# EAGLE design BLE_Emergency_lights_v1.0 (EAGLE 9.6.2)
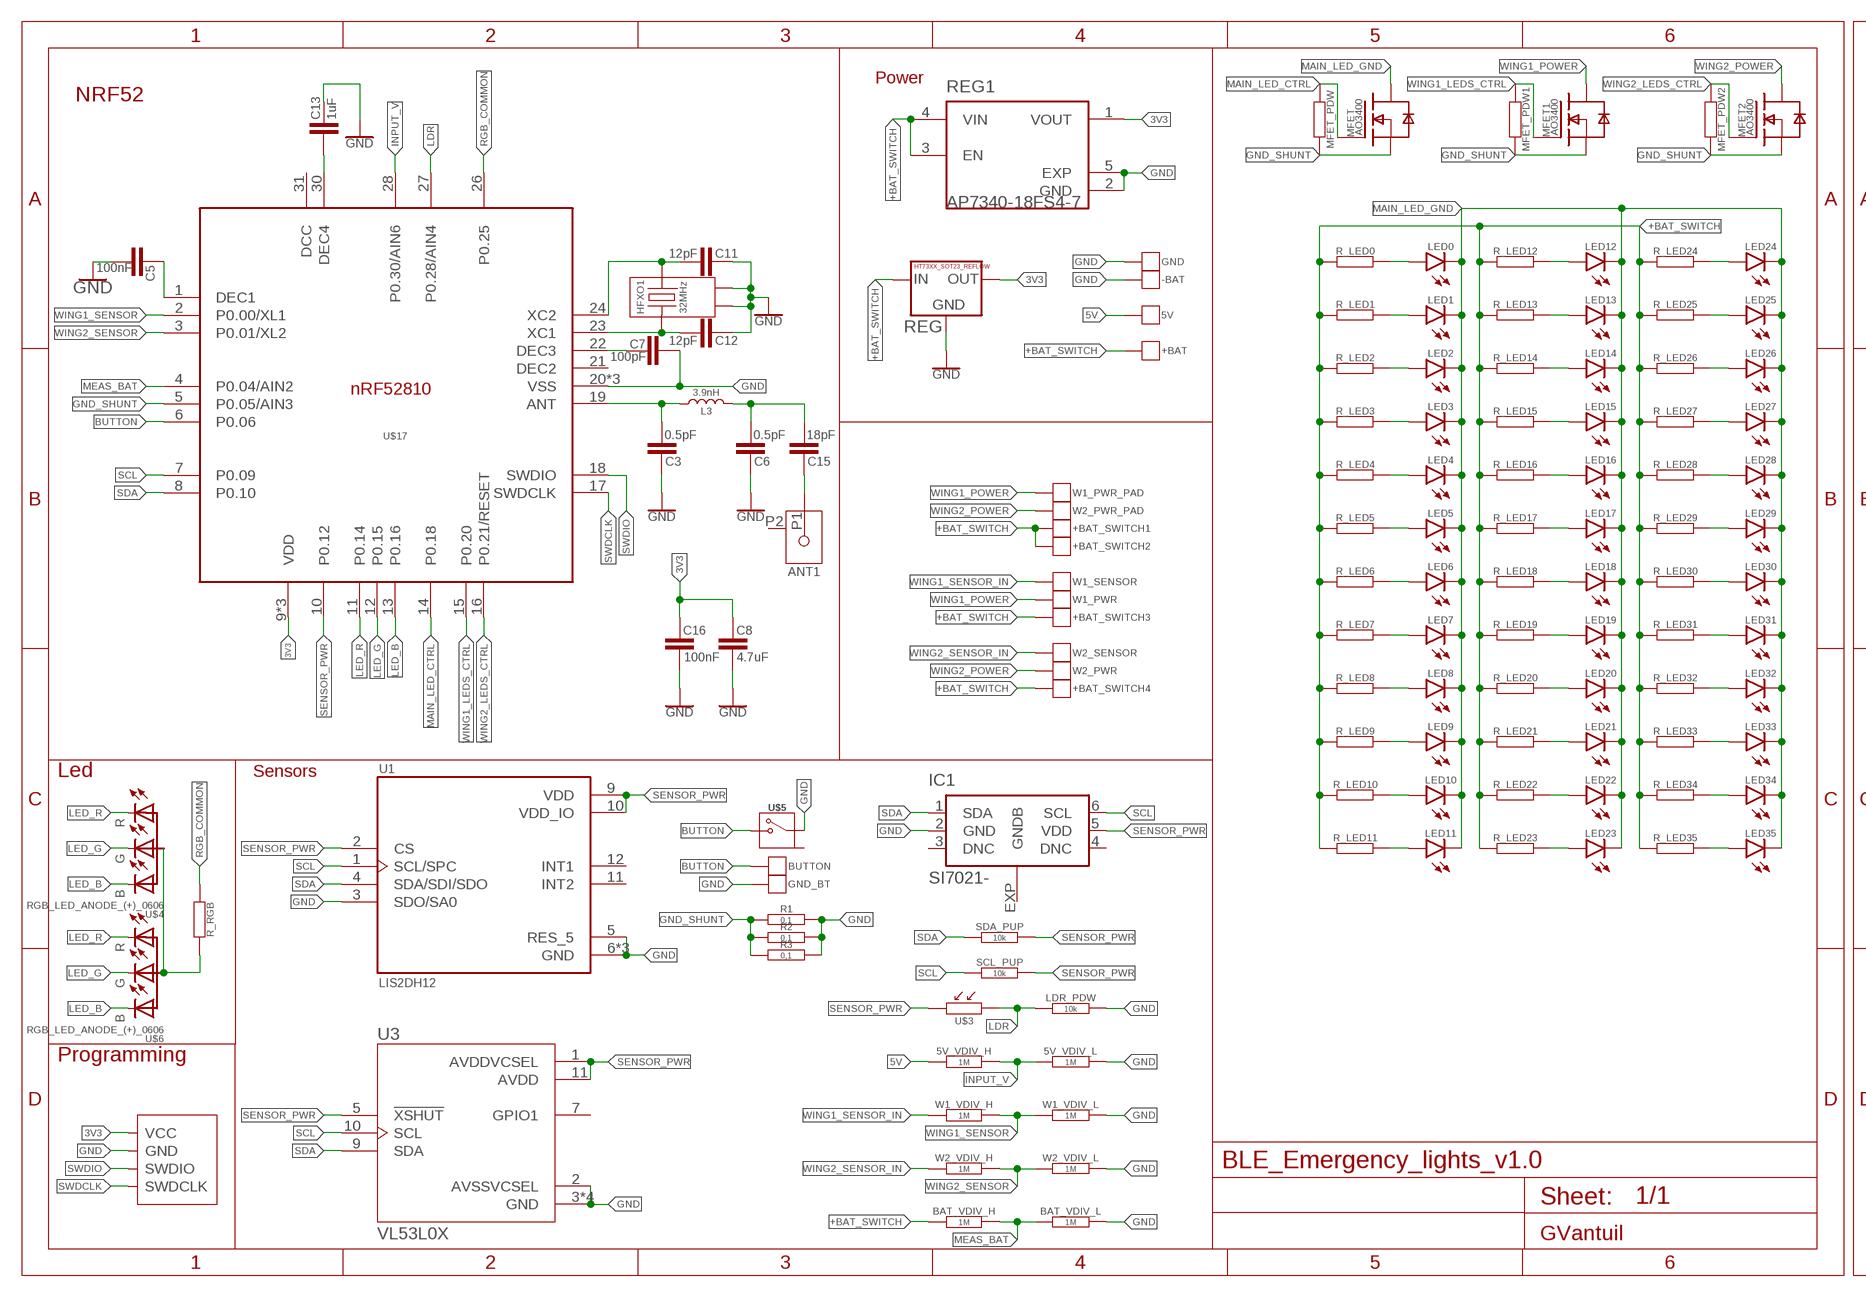
[diagram p0: schematic, sheet 1, part 1 of 2]
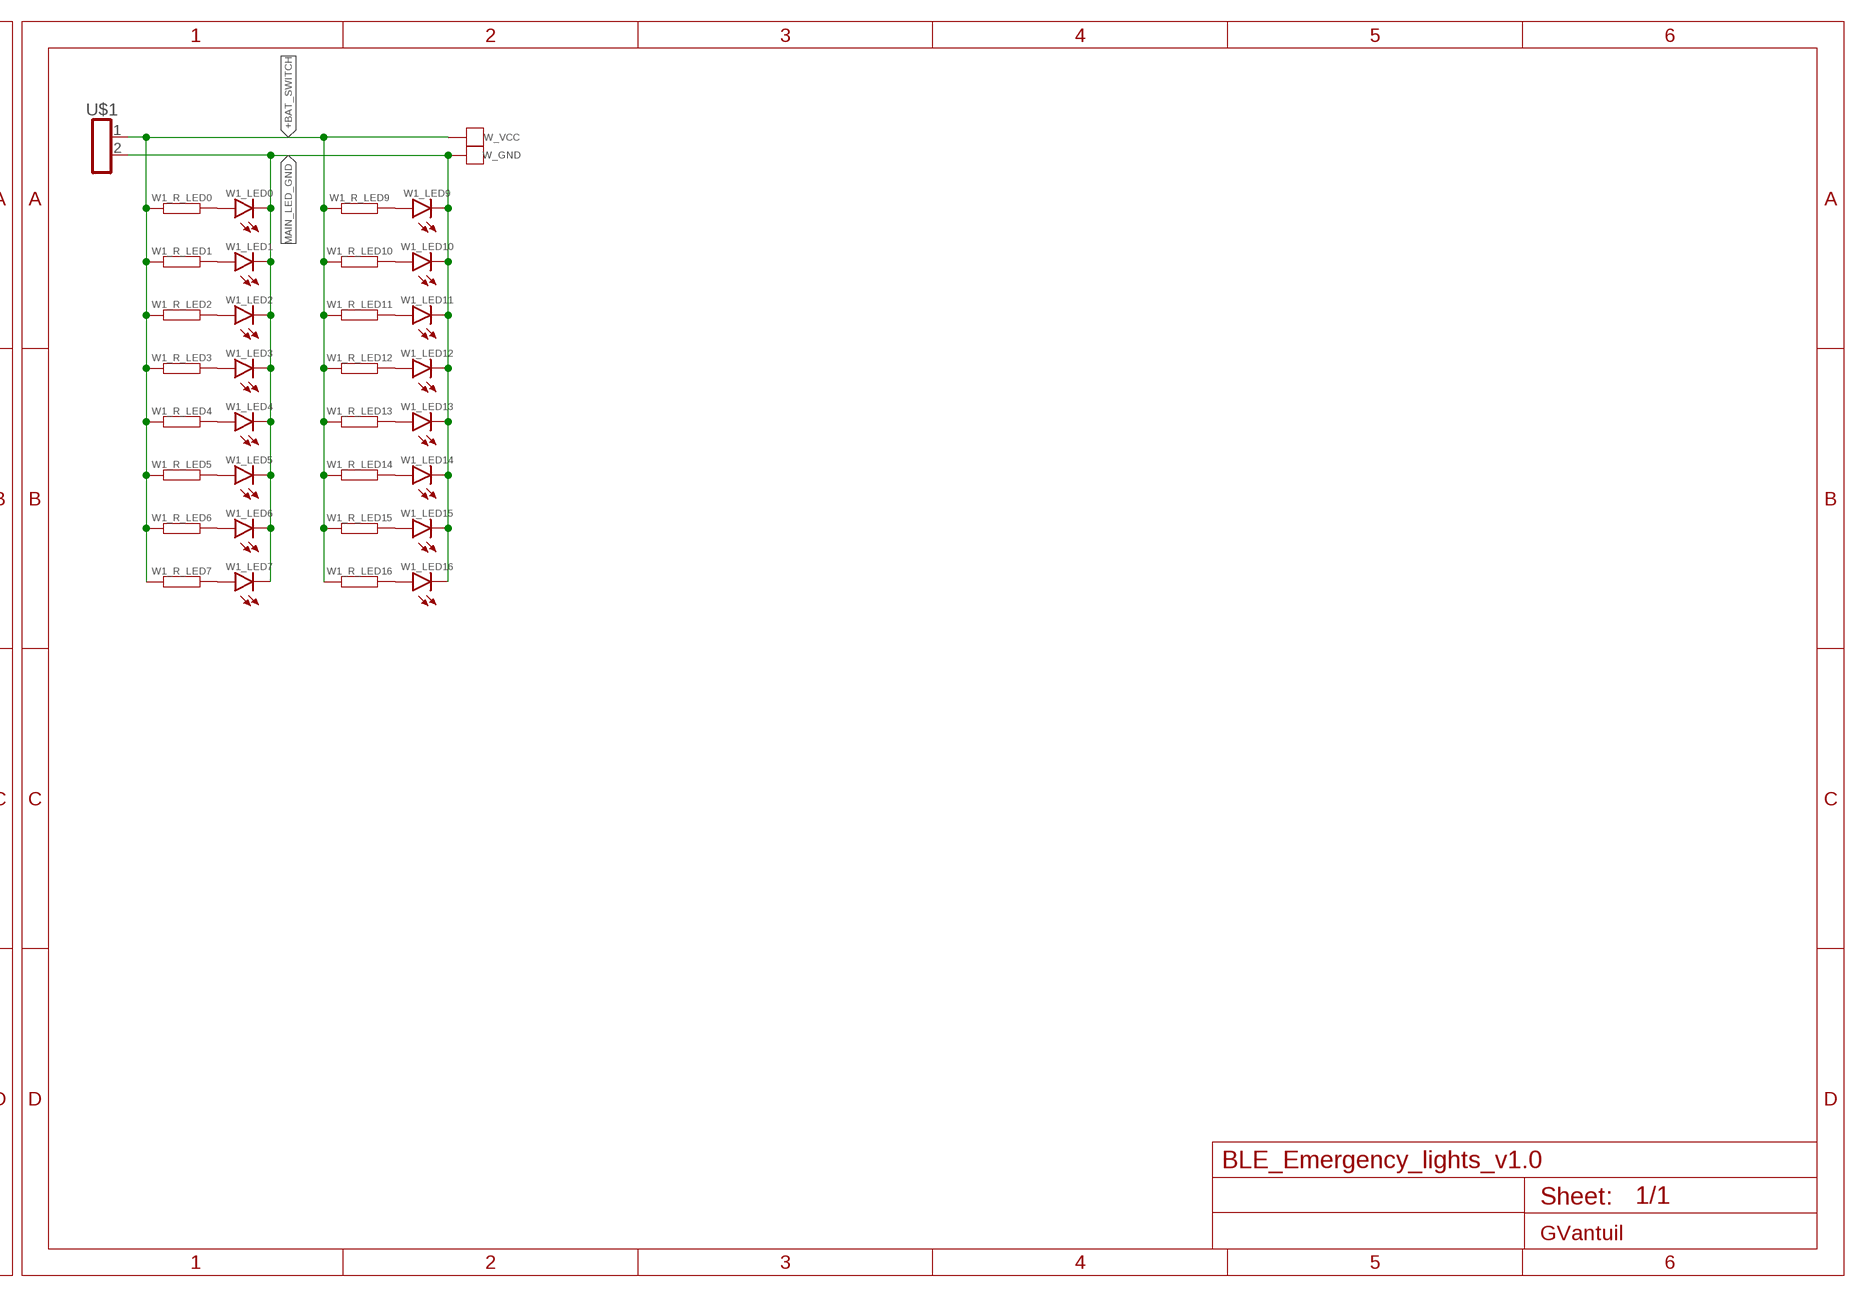
[diagram p1: schematic, sheet 1, part 2 of 2]

## Parts
5V  PAD_50X100MIL  [PAD_50X100MIL]
5V_VDIV_H  1M  RESISTOR0402-RES  [0402-RES]
5V_VDIV_L  1M  RESISTOR0402-RES  [0402-RES]
+BAT  PAD_50X100MIL  [PAD_50X100MIL]
+BAT_SWITCH1  PAD_50X100MIL  [PAD_50X100MIL]
+BAT_SWITCH2  PAD_50X100MIL  [PAD_50X100MIL]
+BAT_SWITCH3  SMD_VERTICAL_POGOPIN_0.8MM  [POGOPIN_0.8T]
+BAT_SWITCH4  SMD_VERTICAL_POGOPIN_0.8MM  [POGOPIN_0.8T]
-BAT  PAD_50X100MIL  [PAD_50X100MIL]
ANT1  ANT3216LL00R2400A  [ANT3216LL00R2400A]
BAT_VDIV_H  1M  RESISTOR0402-RES  [0402-RES]
BAT_VDIV_L  1M  RESISTOR0402-RES  [0402-RES]
BUTTON  PAD_50X100MIL  [PAD_50X100MIL]
C3  0.5pF  CAP_0201_LARGE_FP-CAP  [0201_LARGE_FP-CAP]
C5  100nF  CAP_0201_LARGE_FP-CAP  [0201_LARGE_FP-CAP]
C6  0.5pF  CAP_0201_LARGE_FP-CAP  [0201_LARGE_FP-CAP]
C7  100pF  CAP_0201_LARGE_FP-CAP  [0201_LARGE_FP-CAP]
C8  4.7uF  CAP_0402-CAP  [0402-CAP]
C11  12pF  CAP_0201_LARGE_FP-CAP  [0201_LARGE_FP-CAP]
C12  12pF  CAP_0201_LARGE_FP-CAP  [0201_LARGE_FP-CAP]
C13  1uF  CAP_0201_LARGE_FP-CAP  [0201_LARGE_FP-CAP]
C15  18pF  CAP_0201_LARGE_FP-CAP  [0201_LARGE_FP-CAP]
C16  100nF  CAP_0201_LARGE_FP-CAP  [0201_LARGE_FP-CAP]
GND  PAD_50X100MIL  [PAD_50X100MIL]
GND_BT  PAD_50X100MIL  [PAD_50X100MIL]
HFXO1  32MHz  XTAL_CX2016DB16000D0WZRC1  [XTAL_CX2016DB16000D0WZRC1]
IC1  SI7021-  [DFN6-3X3]
L3  3.9nH  IND_0201_LARGE_FP  [0201_LARGE_FP-CAP]
LDR_PDW  10k  RESISTOR0402-RES  [0402-RES]
LED0  LED_1210  [1210]
LED1  LED_1210  [1210]
LED2  LED_1210  [1210]
LED3  LED_1210  [1210]
LED4  LED_1210  [1210]
LED5  LED_1210  [1210]
LED6  LED_1210  [1210]
LED7  LED_1210  [1210]
LED8  LED_1210  [1210]
LED9  LED_1210  [1210]
LED10  LED_1210  [1210]
LED11  LED_1210  [1210]
LED12  LED_1210  [1210]
LED13  LED_1210  [1210]
LED14  LED_1210  [1210]
LED15  LED_1210  [1210]
LED16  LED_1210  [1210]
LED17  LED_1210  [1210]
LED18  LED_1210  [1210]
LED19  LED_1210  [1210]
LED20  LED_1210  [1210]
LED21  LED_1210  [1210]
LED22  LED_1210  [1210]
LED23  LED_1210  [1210]
LED24  LED_1210  [1210]
LED25  LED_1210  [1210]
LED26  LED_1210  [1210]
LED27  LED_1210  [1210]
LED28  LED_1210  [1210]
LED29  LED_1210  [1210]
LED30  LED_1210  [1210]
LED31  LED_1210  [1210]
LED32  LED_1210  [1210]
LED33  LED_1210  [1210]
LED34  LED_1210  [1210]
LED35  LED_1210  [1210]
MFET  AO3400  [SOT23-3]
MFET1  AO3400  [SOT23-3]
MFET2  AO3400  [SOT23-3]
MFET_PDW  RESISTOR0402-RES  [0402-RES]
MFET_PDW1  RESISTOR0402-RES  [0402-RES]
MFET_PDW2  RESISTOR0402-RES  [0402-RES]
R1  0,1  RESISTOR1206  [1206]
R2  0,1  RESISTOR1206  [1206]
R3  0,1  RESISTOR1206  [1206]
R_LED0  RESISTOR0603-RES  [0603-RES]
R_LED1  RESISTOR0603-RES  [0603-RES]
R_LED2  RESISTOR0603-RES  [0603-RES]
R_LED3  RESISTOR0603-RES  [0603-RES]
R_LED4  RESISTOR0603-RES  [0603-RES]
R_LED5  RESISTOR0603-RES  [0603-RES]
R_LED6  RESISTOR0603-RES  [0603-RES]
R_LED7  RESISTOR0603-RES  [0603-RES]
R_LED8  RESISTOR0603-RES  [0603-RES]
R_LED9  RESISTOR0603-RES  [0603-RES]
R_LED10  RESISTOR0603-RES  [0603-RES]
R_LED11  RESISTOR0603-RES  [0603-RES]
R_LED12  RESISTOR0603-RES  [0603-RES]
R_LED13  RESISTOR0603-RES  [0603-RES]
R_LED14  RESISTOR0603-RES  [0603-RES]
R_LED15  RESISTOR0603-RES  [0603-RES]
R_LED16  RESISTOR0603-RES  [0603-RES]
R_LED17  RESISTOR0603-RES  [0603-RES]
R_LED18  RESISTOR0603-RES  [0603-RES]
R_LED19  RESISTOR0603-RES  [0603-RES]
R_LED20  RESISTOR0603-RES  [0603-RES]
R_LED21  RESISTOR0603-RES  [0603-RES]
R_LED22  RESISTOR0603-RES  [0603-RES]
R_LED23  RESISTOR0603-RES  [0603-RES]
R_LED24  RESISTOR0603-RES  [0603-RES]
R_LED25  RESISTOR0603-RES  [0603-RES]
R_LED26  RESISTOR0603-RES  [0603-RES]
R_LED27  RESISTOR0603-RES  [0603-RES]
R_LED28  RESISTOR0603-RES  [0603-RES]
R_LED29  RESISTOR0603-RES  [0603-RES]
R_LED30  RESISTOR0603-RES  [0603-RES]
R_LED31  RESISTOR0603-RES  [0603-RES]
R_LED32  RESISTOR0603-RES  [0603-RES]
R_LED33  RESISTOR0603-RES  [0603-RES]
R_LED34  RESISTOR0603-RES  [0603-RES]
R_LED35  RESISTOR0603-RES  [0603-RES]
R_RGB  RESISTOR_0201_LARGE_FP  [0201_LARGE_FT-RES]
REG  HT73XX_SOT23_REFLOW  [SOT23-R]
REG1  AP7340-18FS4-7  [VREG_AP7340-18FS4-7]
SCL_PUP  10k  RESISTOR0402-RES  [0402-RES]
SDA_PUP  10k  RESISTOR0402-RES  [0402-RES]
U1  LIS2DH12  [SENSOR_LIS2DH12]
U3  VL53L0X  [SENSOR_VL53L0X]
U$1  RING_PAD_02_4X6  [2X_RING_PAD_4X6]
U$3  LDR_5MM  [LDR_5MM]
U$4  RGB_LED_ANODE_(+)_0606  [LED_RGB_0606]
U$5  PUSHBUTTON_2X4X3.5  [2X4X3.5MM]
U$6  RGB_LED_ANODE_(+)_0606  [LED_RGB_0606]
U$9  GV_SWD_4P  [GV_SWD_1.27MM_4P_SEMI_SMD]
U$17  NRF52810-QFN32  [QFN32-SMALL_PADS2]
W1_LED0  LED_1210  [1210]
W1_LED1  LED_1210  [1210]
W1_LED2  LED_1210  [1210]
W1_LED3  LED_1210  [1210]
W1_LED4  LED_1210  [1210]
W1_LED5  LED_1210  [1210]
W1_LED6  LED_1210  [1210]
W1_LED7  LED_1210  [1210]
W1_LED9  LED_1210  [1210]
W1_LED10  LED_1210  [1210]
W1_LED11  LED_1210  [1210]
W1_LED12  LED_1210  [1210]
W1_LED13  LED_1210  [1210]
W1_LED14  LED_1210  [1210]
W1_LED15  LED_1210  [1210]
W1_LED16  LED_1210  [1210]
W1_PWR  SMD_VERTICAL_POGOPIN_0.8MM  [POGOPIN_0.8T]
W1_PWR_PAD  PAD_50X100MIL  [PAD_50X100MIL]
W1_R_LED0  RESISTOR0603-RES  [0603-RES]
W1_R_LED1  RESISTOR0603-RES  [0603-RES]
W1_R_LED2  RESISTOR0603-RES  [0603-RES]
W1_R_LED3  RESISTOR0603-RES  [0603-RES]
W1_R_LED4  RESISTOR0603-RES  [0603-RES]
W1_R_LED5  RESISTOR0603-RES  [0603-RES]
W1_R_LED6  RESISTOR0603-RES  [0603-RES]
W1_R_LED7  RESISTOR0603-RES  [0603-RES]
W1_R_LED9  RESISTOR0603-RES  [0603-RES]
W1_R_LED10  RESISTOR0603-RES  [0603-RES]
W1_R_LED11  RESISTOR0603-RES  [0603-RES]
W1_R_LED12  RESISTOR0603-RES  [0603-RES]
W1_R_LED13  RESISTOR0603-RES  [0603-RES]
W1_R_LED14  RESISTOR0603-RES  [0603-RES]
W1_R_LED15  RESISTOR0603-RES  [0603-RES]
W1_R_LED16  RESISTOR0603-RES  [0603-RES]
W1_SENSOR  SMD_VERTICAL_POGOPIN_0.8MM  [POGOPIN_0.8T]
W1_VDIV_H  1M  RESISTOR0402-RES  [0402-RES]
W1_VDIV_L  1M  RESISTOR0402-RES  [0402-RES]
W2_PWR  SMD_VERTICAL_POGOPIN_0.8MM  [POGOPIN_0.8T]
W2_PWR_PAD  PAD_50X100MIL  [PAD_50X100MIL]
W2_SENSOR  SMD_VERTICAL_POGOPIN_0.8MM  [POGOPIN_0.8T]
W2_VDIV_H  1M  RESISTOR0402-RES  [0402-RES]
W2_VDIV_L  1M  RESISTOR0402-RES  [0402-RES]
W_GND  PINH1X01_0.8MM  [0.8MM]
W_VCC  PINH1X01_0.8MM  [0.8MM]

## Nets
3V3: C8.1 C16.1 REG1.1(VOUT) REG.2(3.OUT) U$9.VCC U$17.9(VDD) U$17.25(VDD) U$17.32(VDD)
5V: 5V.P$1 5V_VDIV_H.2
+BAT_SWITCH: +BAT.P$1 +BAT_SWITCH1.P$1 +BAT_SWITCH2.P$1 +BAT_SWITCH3.P$1 +BAT_SWITCH4.P$1 BAT_VDIV_H.2 R_LED0.1 R_LED1.1 R_LED2.1 R_LED3.1 R_LED4.1 R_LED5.1 R_LED6.1 R_LED7.1 R_LED8.1 R_LED9.1 R_LED10.1 R_LED11.1 R_LED12.1 R_LED13.1 R_LED14.1 R_LED15.1 R_LED16.1 R_LED17.1 R_LED18.1 R_LED19.1 R_LED20.1 R_LED21.1 R_LED22.1 R_LED23.1 R_LED24.1 R_LED25.1 R_LED26.1 R_LED27.1 R_LED28.1 R_LED29.1 R_LED30.1 R_LED31.1 R_LED32.1 R_LED33.1 R_LED34.1 R_LED35.1 REG1.3(EN) REG1.4(VIN) REG.3(1.IN) U$1.1 W1_R_LED0.1 W1_R_LED1.1 W1_R_LED2.1 W1_R_LED3.1 W1_R_LED4.1 W1_R_LED5.1 W1_R_LED6.1 W1_R_LED7.1 W1_R_LED9.1 W1_R_LED10.1 W1_R_LED11.1 W1_R_LED12.1 W1_R_LED13.1 W1_R_LED14.1 W1_R_LED15.1 W1_R_LED16.1 W_VCC.P$1
ANT1: C3.1 L3.1 U$17.19(ANT)
ANT2: C6.1 C15.1 L3.2
BUTTON: BUTTON.P$1 U$5.1 U$17.6(P0.06)
GND: 5V_VDIV_L.2 -BAT.P$1 BAT_VDIV_L.2 C3.2 C5.2 C6.2 C7.1 C8.2 C11.1 C12.1 C13.1 C16.2 GND.P$1 GND_BT.P$1 HFXO1.2 HFXO1.4 IC1.2(GND) LDR_PDW.2 R1.2 R2.2 R3.2 REG1.2(GND) REG1.5(EXP) REG.1(2.GND) U1.3(SDO/SA0) U1.5(RES_5) U1.6(GND) U1.7(GND) U1.8(GND) U3.2(AVSSVCSEL) U3.3(GND) U3.4(GND) U3.6(GND) U3.12(GND) U$5.2 U$9.GND U$17.20(VSS) U$17.29(VSS) U$17.EXP(VSS) W1_VDIV_L.2 W2_VDIV_L.2
GND_SHUNT: MFET1.2(S) MFET2.2(S) MFET.2(S) MFET_PDW1.2 MFET_PDW2.2 MFET_PDW.2 R1.1 R2.1 R3.1 U$17.5(P0.05/AIN3)
INPUT_V: 5V_VDIV_H.1 5V_VDIV_L.1 U$17.28(P0.30/AIN6)
LDR: LDR_PDW.1 U$3.P$2 U$17.27(P0.28/AIN4)
LED_B: U$4.B(LED_BLUE) U$6.B(LED_BLUE) U$17.13(P0.16)
LED_G: U$4.G(LED_GREEN) U$6.G(LED_GREEN) U$17.12(P0.15)
LED_R: U$4.R(LED_RED) U$6.R(LED_RED) U$17.11(P0.14)
MAIN_LED_CTRL: MFET.1(G) MFET_PDW.1 U$17.14(P0.18)
MAIN_LED_GND [pwr]: LED0.C LED1.C LED2.C LED3.C LED4.C LED5.C LED6.C LED7.C LED8.C LED9.C LED10.C LED11.C LED12.C LED13.C LED14.C LED15.C LED16.C LED17.C LED18.C LED19.C LED20.C LED21.C LED22.C LED23.C LED24.C LED25.C LED26.C LED27.C LED28.C LED29.C LED30.C LED31.C LED32.C LED33.C LED34.C LED35.C MFET.3(D) U$1.2 W1_LED0.C W1_LED1.C W1_LED2.C W1_LED3.C W1_LED4.C W1_LED5.C W1_LED6.C W1_LED7.C W1_LED9.C W1_LED10.C W1_LED11.C W1_LED12.C W1_LED13.C W1_LED14.C W1_LED15.C W1_LED16.C W_GND.P$1
MEAS_BAT: BAT_VDIV_H.1 BAT_VDIV_L.1 U$17.4(P0.04/AIN2)
N$3: ANT1.P1 C15.2
N$4: C7.2 U$17.22(DEC3)
N$5 [pwr]: LED0.A R_LED0.2
N$6: C13.2 U$17.30(DEC4)
N$8 [pwr]: LED1.A R_LED1.2
N$9: R_RGB.2 U$4.COM(COMMON_ANODE) U$6.COM(COMMON_ANODE)
N$10 [pwr]: LED2.A R_LED2.2
N$11: C12.2 HFXO1.3 U$17.23(XC1)
N$12: C11.2 HFXO1.1 U$17.24(XC2)
N$13 [pwr]: LED3.A R_LED3.2
N$14: C5.1 U$17.1(DEC1)
N$15 [pwr]: LED4.A R_LED4.2
N$17 [pwr]: LED5.A R_LED5.2
N$18 [pwr]: LED6.A R_LED6.2
N$19 [pwr]: LED7.A R_LED7.2
N$20 [pwr]: LED8.A R_LED8.2
N$21 [pwr]: LED9.A R_LED9.2
N$22 [pwr]: LED10.A R_LED10.2
N$23 [pwr]: LED11.A R_LED11.2
N$24 [pwr]: LED12.A R_LED12.2
N$25 [pwr]: LED13.A R_LED13.2
N$26 [pwr]: LED14.A R_LED14.2
N$27 [pwr]: LED15.A R_LED15.2
N$28 [pwr]: LED16.A R_LED16.2
N$29 [pwr]: LED17.A R_LED17.2
N$30 [pwr]: LED18.A R_LED18.2
N$31 [pwr]: LED19.A R_LED19.2
N$32 [pwr]: LED20.A R_LED20.2
N$33 [pwr]: LED21.A R_LED21.2
N$34 [pwr]: LED22.A R_LED22.2
N$35 [pwr]: LED23.A R_LED23.2
N$36 [pwr]: LED24.A R_LED24.2
N$37 [pwr]: LED25.A R_LED25.2
N$38 [pwr]: LED26.A R_LED26.2
N$39 [pwr]: LED27.A R_LED27.2
N$40 [pwr]: LED28.A R_LED28.2
N$41 [pwr]: LED29.A R_LED29.2
N$42 [pwr]: LED30.A R_LED30.2
N$43 [pwr]: LED31.A R_LED31.2
N$44 [pwr]: LED32.A R_LED32.2
N$45 [pwr]: LED33.A R_LED33.2
N$46 [pwr]: LED34.A R_LED34.2
N$47 [pwr]: LED35.A R_LED35.2
N$48: W1_LED0.A W1_R_LED0.2
N$49: W1_LED1.A W1_R_LED1.2
N$50: W1_LED2.A W1_R_LED2.2
N$51: W1_LED3.A W1_R_LED3.2
N$52: W1_LED4.A W1_R_LED4.2
N$53: W1_LED5.A W1_R_LED5.2
N$54: W1_LED6.A W1_R_LED6.2
N$55: W1_LED7.A W1_R_LED7.2
N$59: W1_LED9.A W1_R_LED9.2
N$60: W1_LED10.A W1_R_LED10.2
N$61: W1_LED11.A W1_R_LED11.2
N$62: W1_LED12.A W1_R_LED12.2
N$63: W1_LED13.A W1_R_LED13.2
N$64: W1_LED14.A W1_R_LED14.2
N$65: W1_LED15.A W1_R_LED15.2
N$66: W1_LED16.A W1_R_LED16.2
RGB_COMMON: R_RGB.1 U$17.26(P0.25)
SCL: IC1.6(SCL) SCL_PUP.1 U1.1(SCL/SPC) U3.10(SCL) U$17.7(P0.09)
SDA: IC1.1(SDA) SDA_PUP.1 U1.4(SDA/SDI/SDO) U3.9(SDA) U$17.8(P0.10)
SENSOR_PWR: IC1.5(VDD) SCL_PUP.2 SDA_PUP.2 U1.2(CS) U1.9(VDD) U1.10(VDD_IO) U3.1(AVDDVCSEL) U3.5(!XSHUT) U3.11(AVDD) U$3.P$1 U$17.10(P0.12)
SWDCLK: U$9.SWDCLK U$17.17(SWDCLK)
SWDIO: U$9.SWDIO U$17.18(SWDIO)
WING1_LEDS_CTRL: MFET1.1(G) MFET_PDW1.1 U$17.15(P0.20)
WING1_POWER [pwr]: MFET1.3(D) W1_PWR.P$1 W1_PWR_PAD.P$1
WING1_SENSOR: U$17.2(P0.00/XL1) W1_VDIV_H.1 W1_VDIV_L.1
WING1_SENSOR_IN: W1_SENSOR.P$1 W1_VDIV_H.2
WING2_LEDS_CTRL: MFET2.1(G) MFET_PDW2.1 U$17.16(P0.21/RESET)
WING2_POWER [pwr]: MFET2.3(D) W2_PWR.P$1 W2_PWR_PAD.P$1
WING2_SENSOR: U$17.3(P0.01/XL2) W2_VDIV_H.1 W2_VDIV_L.1
WING2_SENSOR_IN: W2_SENSOR.P$1 W2_VDIV_H.2
Unconnected: ANT1.P2 IC1.3(DNC) IC1.4(DNC) IC1.EXP(GNDB) U1.11(INT2) U1.12(INT1) U3.7(GPIO1) U$5.SHIELD2(GND) U$5.SHIELD(GND) U$17.21(DEC2) U$17.31(DCC)

## Notes on the sheet
- Power
- NRF52
- Led | Sensors
- Programming

## Library data of the parts
5V +BAT +BAT_SWITCH1 +BAT_SWITCH2 -BAT BUTTON GND GND_BT W1_PWR_PAD W2_PWR_PAD = 0000_GV_connectors:PAD
5V_VDIV_H 5V_VDIV_L BAT_VDIV_H BAT_VDIV_L LDR_PDW MFET_PDW MFET_PDW1 MFET_PDW2 R1-R3 R_LED0 R_LED1-R_LED35 R_RGB SCL_PUP SDA_PUP W1_R_LED0 W1_R_LED1-W1_R_LED7 W1_R_LED9-W1_R_LED16 W1_VDIV_H W1_VDIV_L W2_VDIV_H W2_VDIV_L = 0000_GV_resistors:RESISTOR: Resistor Basic schematic elements and footprints for 0603, 1206, and PTH 1/10th watt (small) resistors.
+BAT_SWITCH3 +BAT_SWITCH4 W1_PWR W1_SENSOR W2_PWR W2_SENSOR = 0000_GV_connectors:SMD_VERTICAL_POGOPIN
ANT1 = 0000_GV_antennas:ANT3216LL00R2400A
C3 C5-C8 C11-C13 C15 C16 = 0000_GV_capacitors:CAP_: Capacitor Standard 0603 ceramic capacitor, and 0.1" leaded capacitor.
HFXO1 = 0000_GV_cristal_and _timers:XTAL: Crystal 16MHz 8pF 4-Pin SMD Check availability <https://pricing.snapeda.com/parts/CX2016DB16000D0WZRC1/Kyocera%20AVX/view-part?ref=eda>; AVAILABILITY: In Stock; MF: Kyocera AVX; MP: CX2016DB16000D0WZRC1; PACKAGE: None; PRICE: None; PURCHASE-URL: https://pricing.snapeda.com/search/part/CX2016DB16000D0WZRC1/?ref=eda
IC1 = 0000_GV_sensors:SI7021-*: I2C Humidity and Temperature Sensor Source: http://www.silabs.com/Support%20Documents/TechnicalDocs/Si7021.pdf
L3 = 0000_GV_inductors:IND
LED0 LED1-LED35 W1_LED0 W1_LED1-W1_LED7 W1_LED9-W1_LED16 = 0000_GV_Leds:LED
MFET MFET1 MFET2 = 0000_GV_transistors:AO3400: Check prices <https://pricing.snapeda.com/parts/AO3400/Alpha%20%26/view-part?ref=eda>
REG = 0000_GV_regulators:HT73XX
REG1 = 0000_GV_regulators:AP7340-18FS4-7: Linear Voltage Regulator IC 1 Output 150mA X2-DFN1010-4 Check availability <https://pricing.snapeda.com/parts/AP7340-18FS4-7/Diodes%20Inc./view-part?ref=eda>; AVAILABILITY: In Stock; CHECK_PRICES: https://www.snapeda.com/parts/AP7340-18FS4-7/Diodes+Inc./view-part/?ref=eda; DESCRIPTION: Linear Voltage Regulator IC Positive Fixed 1 Output 150mA X2-DFN1010-4; MF: Diodes Inc.; MP: AP7340-18FS4-7; PACKAGE: XDFN-4 Diodes Incorporated; PRICE: None; SNAPEDA_LINK: https://www.snapeda.com/parts/AP7340-18FS4-7/Diodes+Inc./view-part/?ref=snap
U1 = 0000_GV_sensors:LIS2DH12: MEMS digital output motion sensor: ultra low-power high performance 3-axes femto accelerometer Check availability <https://pricing.snapeda.com/parts/LIS2DH12/STMicroelectronics/view-part?ref=eda>; AVAILABILITY: In Stock; CHECK_PRICES: https://www.snapeda.com/parts/LIS2DH12/STMicroelectronics/view-part/?ref=eda; DESCRIPTION: Accelerometer X, Y, Z Axis ±2g, 4g, 8g, 16g 0.5Hz ~ 672Hz 12-LGA (2x2); MF: STMicroelectronics; MP: LIS2DH12; PACKAGE: LGA-12 STMicroelectronics; PRICE: None; SNAPEDA_LINK: https://www.snapeda.com/parts/LIS2DH12/STMicroelectronics/view-part/?ref=snap
U3 = 0000_GV_sensors:VL53L0X: World smallest Time-of-Flight ranging and gesture detection sensor Check availability <https://pricing.snapeda.com/parts/VL53L0X/STMicroelectronics/view-part?ref=eda>; AVAILABILITY: Not in stock; CHECK_PRICES: https://www.snapeda.com/parts/VL53L0X/STMicroelectronics/view-part/?ref=eda; DESCRIPTION: STM32F401RE, VL53L0X, mbed-Enabled Development series Light, 3D Time-of-Flight (ToF) Sensor Evaluation Board; MF: STMicroelectronics; MP: VL53L0X; PACKAGE: None; PRICE: None; SNAPEDA_LINK: https://www.snapeda.com/parts/VL53L0X/STMicroelectronics/view-part/?ref=snap
U$1 = 0000_GV_connectors:RING_PAD_02
U$3 = 0000_GV_sensors:LDR
U$4 U$6 = 0000_GV_Leds:RGB_LED_ANODE_(+)
U$5 = 0000_GV_switches:PUSHBUTTON_2X4X3.5
U$9 = 0000_GV_connectors:GV_SWD_4P
U$17 = 0000_GV_MCUs:NRF52810-QFN32
W_GND W_VCC = 0000_GV_connectors:PINH1X01

## Net classes
1 pwr: width 1.016 mm, drill 0.914 mm

## Board
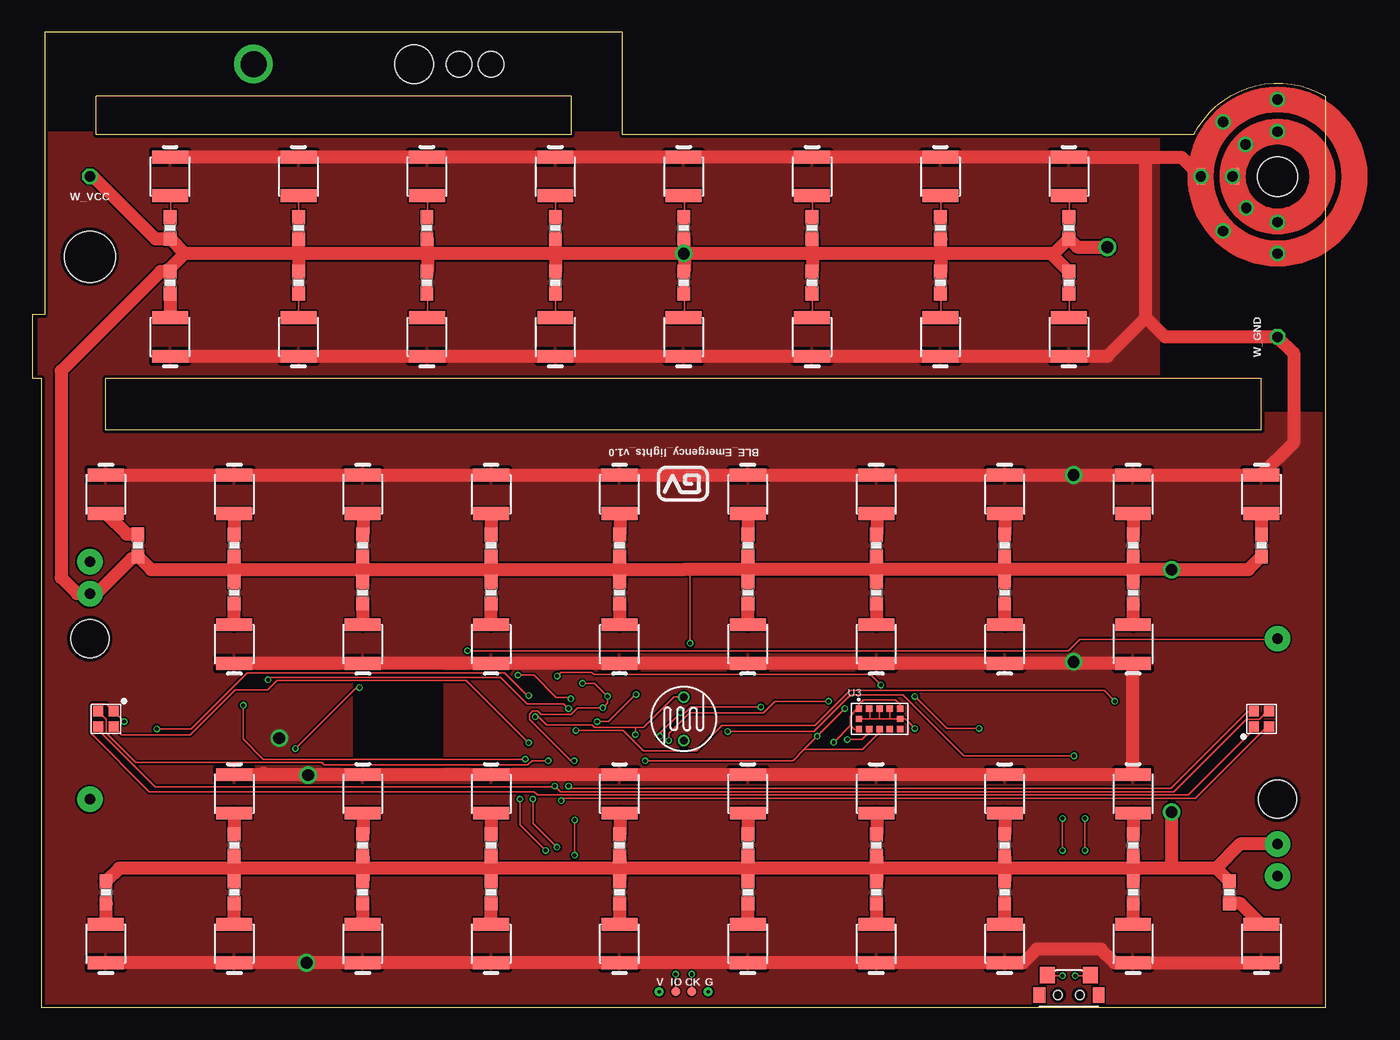
[diagram p2: board, top side]
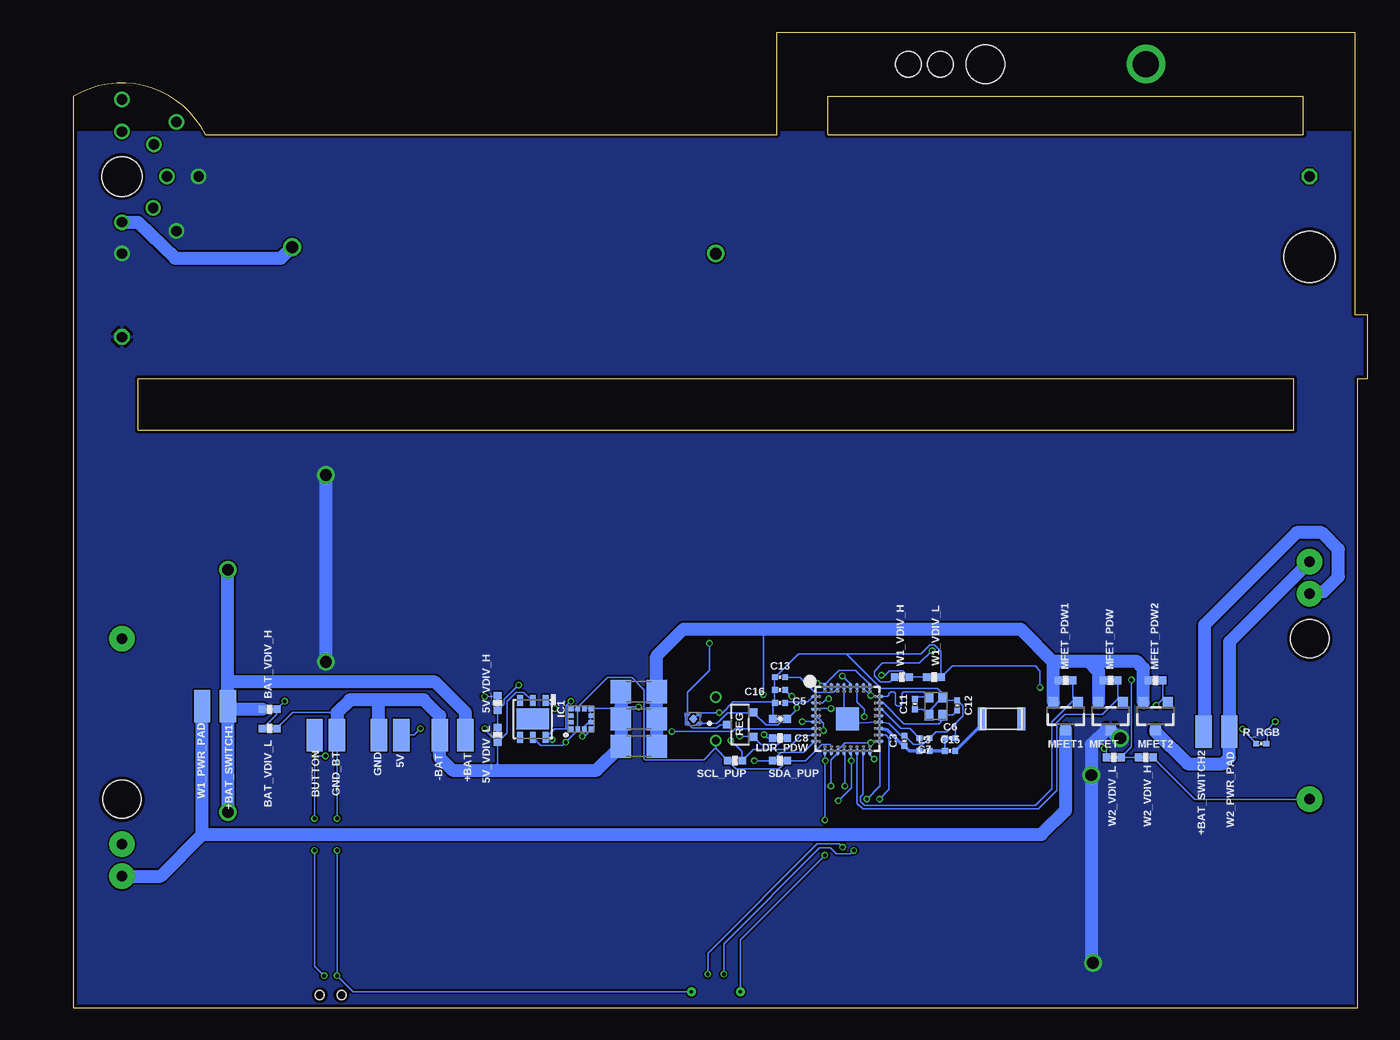
[diagram p3: board, bottom side, seen from below]

Size 100.75 x 76 mm. Coordinates in mm from the lower left corner, seen from the top.
Outline: 100.75,0 100.75,45 100.75,71 arc94 90.5,68 46,68 46,76 1,76 1,54 0,54 0,49 0.75,49 0.75,45 0.75,0 100.75,0
Outline: 55.75,45 7,45 5.75,45 5.75,49 95.75,49 95.75,45 93.25,45 92.75,45 55.75,45
Outline: 42,68 5,68 5,71 42,71 42,68
Copper layers (1*16): Top 0.035mm / dielectric 1.5mm / Bottom 0.035mm
Design rules "jlcpcb-2layers *": minimum track width 5mil, minimum drill 12mil, track to track 5mil, track to pad 4mil, pad to pad 5mil, via to via 5mil, smd to smd 0mil, copper to edge 10mil, drill to drill 10mil, minimum pad ring 4mil, minimum via ring 4mil, stop-mask expansion 2mil, vias tented up to drill 100mil, thermal gap 10mil
Holes 3 mm at 97,16.25 4.5,28.75 29.75,73.5
Holes 4 mm at 4.5,58.5
Holes 2 mm at 33.25,73.5 35.75,73.5
tKeepout: area 93.5,12.8 to 100.5,19.8; area 1,25.2 to 8,32.2
tRestrict: area 25,18.2 to 32,26.4
bRestrict: area 25,18 to 32,26.1

### Footprints (pad centres in the part's own frame; a part is rotated, then mirrored left to right if it is on the bottom)
PAD_50X100MIL = smd 1.27 x 2.54: P$1 0,0
0402-RES = smd 0.6 x 0.6: 1 -0.55,0; 2 0.55,0
POGOPIN_0.8T = drill 0.8 pad 2: P$1 0,0
ANT3216LL00R2400A = smd 1.8 x 0.6: P1 0,1.55; P2 0,-1.55
0201_LARGE_FP-CAP = smd 0.45 x 0.45: 1 -0.4,0; 2 0.4,0
0402-CAP = smd 0.6 x 0.6: 1 -0.55,0; 2 0.55,0
XTAL_CX2016DB16000D0WZRC1 = smd 0.8 x 0.7: 1 -0.7,-0.55; 2 0.7,-0.55; 3 0.7,0.55; 4 -0.7,0.55
DFN6-3X3 = smd 0.85 x 0.45: 1 -1.45,1; 2 -1.45,0; 3 -1.45,-1; 4 1.45,-1; 5 1.45,0; 6 1.45,1 | smd 1.6 x 2.5: EXP 0,0
1210 = smd 1 x 2.8: A 1.5,0; C -1.5,0
SOT23-3 = smd 0.8 x 0.9: 1 -0.95,-1; 2 0.95,-1; 3 0,1.1
1206 = smd 1.6 x 1.8: 1 -1.4,0; 2 1.4,0
0603-RES = smd 1.1 x 1: 1 -0.85,0; 2 0.85,0
0201_LARGE_FT-RES = smd 0.45 x 0.45: 1 -0.4,0; 2 0.4,0
SOT23-R = smd 0.6 x 0.7: 1 -0.95,-1; 2 0.95,-1; 3 0,1
VREG_AP7340-18FS4-7 = smd 0.1 x 0.1: 1 -0.45,0.325; 2 -0.45,-0.325; 3 0.45,-0.325; 4 0.45,0.325 | smd 0.48 x 0.48 rotated 45: 5 0,0
SENSOR_LIS2DH12 = smd 0.375 x 0.35: 1 -0.762,0.75; 2 -0.762,0.25; 3 -0.762,-0.25; 4 -0.762,-0.75; 7 0.762,-0.75; 8 0.762,-0.25; 9 0.762,0.25; 10 0.762,0.75 | smd 0.35 x 0.375: 5 -0.25,-0.762; 6 0.25,-0.762; 11 0.25,0.762; 12 -0.25,0.762
SENSOR_VL53L0X = smd 0.5 x 0.5: 1 -1.6,0.8; 2 -0.8,0.8; 3 0,0.8; 4 0.8,0.8; 5 1.6,0.8; 6 1.6,0; 7 1.6,-0.8; 8 0.8,-0.8; 9 0,-0.8; 10 -0.8,-0.8; 11 -1.6,-0.8; 12 -1.6,0
2X_RING_PAD_4X6 = smd 0.635 x 1.27: 1 -3.302,0; 2 -5.969,0 | hole 3.1: 0,0
LDR_5MM = drill 0.6: P$1 -1.7,0; P$2 1.7,0
LED_RGB_0606 = smd 0.8 x 0.8: B -0.6,-0.6; COM -0.6,0.6; G 0.6,-0.6; R 0.6,0.6
2X4X3.5MM = smd 1.15 x 1.3: 1 -1.675,-1.55; 2 1.675,-1.55 | smd 0.9 x 1.2: SHIELD -2.3,0; SHIELD2 2.3,0 | hole 0.7: -0.85,0; 0.85,0
GV_SWD_1.27MM_4P_SEMI_SMD = drill 0.25 pad 0.7: GND 1.905,0; VCC -1.905,0 | smd 0.7 x 0.7: SWDCLK 0.635,0; SWDIO -0.635,0
QFN32-SMALL_PADS2 = smd 0.6 x 0.25: 1 -2.55,1.75; 2 -2.55,1.25; 3 -2.55,0.75; 4 -2.55,0.25; 5 -2.55,-0.25; 6 -2.55,-0.75; 7 -2.55,-1.25; 8 -2.55,-1.75; 17 2.55,-1.75; 18 2.55,-1.25; 19 2.55,-0.75; 20 2.55,-0.25; 21 2.55,0.25; 22 2.55,0.75; 23 2.55,1.25; 24 2.55,1.75 | smd 0.25 x 0.6: 9 -1.75,-2.55; 10 -1.25,-2.55; 11 -0.75,-2.55; 12 -0.25,-2.55; 13 0.25,-2.55; 14 0.75,-2.55; 15 1.25,-2.55; 16 1.75,-2.55; 25 1.75,2.55; 26 1.25,2.55; 27 0.75,2.55; 28 0.25,2.55; 29 -0.25,2.55; 30 -0.75,2.55; 31 -1.25,2.55; 32 -1.75,2.55 | smd 1.778 x 1.778: EXP 0,0
0.8MM = drill 0.8 octagon: P$1 0,0

### Placement (x,y rotation side)
5V  75.25,21.25 180 bottom
5V_VDIV_H  67.75,23.75 90 bottom
5V_VDIV_L  67.75,21.25 270 bottom
+BAT  70.25,21.25 180 bottom
+BAT_SWITCH1  88.75,23.5 0 bottom
+BAT_SWITCH2  12.75,21.5 0 bottom
+BAT_SWITCH3  97,12.75 0 bottom
+BAT_SWITCH4  4.5,32.25 0 top
-BAT  72.25,21.25 180 bottom
ANT1  28.5,22.5 90 bottom
BAT_VDIV_H  85.5,23.25 180 bottom
BAT_VDIV_L  85.5,21.75 0 bottom
BUTTON  82,21.25 0 bottom
C3  36.05,20.8 90 bottom
C5  45.75,23.75 180 bottom
C6  32.5,21 0 bottom
C7  34.5,21 180 bottom
C8  45.75,22.5 180 bottom
C11  35.25,23.65 90 bottom
C12  31.95,23.55 270 bottom
C13  45.75,25.75 0 bottom
C15  32.5,20 0 bottom
C16  45.75,24.75 180 bottom
GND  77,21.25 180 bottom
GND_BT  80.25,21.25 180 bottom
HFXO1  33.6,23.5 270 bottom
IC1  65,22.5 270 bottom
L3  34.5,20 0 bottom
LDR_PDW  45.75,21 0 bottom
LED0  5.75,5 90 top
LED1  15.75,5 90 top
LED2  25.75,5 90 top
LED3  35.75,5 90 top
LED4  45.75,5 90 top
LED5  55.75,5 90 top
LED6  65.75,5 90 top
LED7  75.75,5 90 top
LED8  85.75,5 90 top
LED9  95.75,5 90 top
LED10  15.75,16.67 270 top
LED11  25.75,16.67 270 top
LED12  35.75,16.67 270 top
LED13  45.75,16.67 270 top
LED14  55.75,16.67 270 top
LED15  65.75,16.67 270 top
LED16  75.75,16.67 270 top
LED17  85.75,16.67 270 top
LED18  15.75,28.33 90 top
LED19  25.75,28.33 90 top
LED20  35.75,28.33 90 top
LED21  45.75,28.33 90 top
LED22  55.75,28.33 90 top
LED23  65.75,28.33 90 top
LED24  75.75,28.33 90 top
LED25  85.75,28.33 90 top
LED26  5.75,40 270 top
LED27  15.75,40 270 top
LED28  25.75,40 270 top
LED29  35.75,40 270 top
LED30  45.75,40 270 top
LED31  55.75,40 270 top
LED32  65.75,40 270 top
LED33  75.75,40 270 top
LED34  85.75,40 270 top
LED35  95.75,40 270 top
MFET  20,22.75 180 bottom
MFET1  23.5,22.75 180 bottom
MFET2  16.5,22.75 180 bottom
MFET_PDW  20,25.5 180 bottom
MFET_PDW1  23.5,25.5 180 bottom
MFET_PDW2  16.5,25.5 180 bottom
R1  56.75,22.5 180 bottom
R2  56.75,20.38 180 bottom
R3  56.75,24.62 180 bottom
R_LED0  5.75,9 270 top
R_LED1  15.75,9 270 top
R_LED2  25.75,9 270 top
R_LED3  35.75,9 270 top
R_LED4  45.75,9 270 top
R_LED5  55.75,9 270 top
R_LED6  65.75,9 270 top
R_LED7  75.75,9 270 top
R_LED8  85.75,9 270 top
R_LED9  93.25,9 270 top
R_LED10  15.75,12.67 90 top
R_LED11  25.75,12.67 90 top
R_LED12  35.75,12.67 90 top
R_LED13  45.75,12.67 90 top
R_LED14  55.75,12.67 90 top
R_LED15  65.75,12.67 90 top
R_LED16  75.75,12.67 90 top
R_LED17  85.75,12.67 90 top
R_LED18  15.75,32.33 270 top
R_LED19  25.75,32.33 270 top
R_LED20  35.75,32.33 270 top
R_LED21  45.75,32.33 270 top
R_LED22  55.75,32.33 270 top
R_LED23  65.75,32.33 270 top
R_LED24  75.75,32.33 270 top
R_LED25  85.75,32.33 270 top
R_LED26  8.25,36 90 top
R_LED27  15.75,36 90 top
R_LED28  25.75,36 90 top
R_LED29  35.75,36 90 top
R_LED30  45.75,36 90 top
R_LED31  55.75,36 90 top
R_LED32  65.75,36 90 top
R_LED33  75.75,36 90 top
R_LED34  85.75,36 90 top
R_LED35  95.75,36 90 top
R_RGB  8.27,20.58 0 bottom
REG  48.85,22.05 90 bottom
REG1  52.5,22.5 180 bottom
SCL_PUP  49.25,19.25 180 bottom
SDA_PUP  45.75,19.25 0 bottom
U1  61.25,22.5 90 bottom
U3  66,22.5 0 top
U$1  97,64.75 0 top
U$2  [GV_5MM]  52.75,42.25 180 top
U$3  50.75,22.5 90 top
U$4  95.75,22.5 90 top
U$5  80.75,1 180 top
U$6  5.75,22.5 270 top
U$9  50.75,1.25 0 top
U$17  40.5,22.5 0 bottom
W1_LED0  10.75,52.25 90 top
W1_LED1  20.75,52.25 90 top
W1_LED2  30.75,52.25 90 top
W1_LED3  40.75,52.25 90 top
W1_LED4  50.75,52.25 90 top
W1_LED5  60.75,52.25 90 top
W1_LED6  70.75,52.25 90 top
W1_LED7  80.75,52.25 90 top
W1_LED9  10.75,64.75 270 top
W1_LED10  20.75,64.75 270 top
W1_LED11  30.75,64.75 270 top
W1_LED12  40.75,64.75 270 top
W1_LED13  50.75,64.75 270 top
W1_LED14  60.75,64.75 270 top
W1_LED15  70.75,64.75 270 top
W1_LED16  80.75,64.75 270 top
W1_PWR  97,10.25 0 bottom
W1_PWR_PAD  90.75,23.5 180 bottom
W1_R_LED0  10.75,56.5 270 top
W1_R_LED1  20.75,56.5 270 top
W1_R_LED2  30.75,56.5 270 top
W1_R_LED3  40.75,56.5 270 top
W1_R_LED4  50.75,56.5 270 top
W1_R_LED5  60.75,56.5 270 top
W1_R_LED6  70.75,56.5 270 top
W1_R_LED7  80.75,56.5 270 top
W1_R_LED9  10.75,60.75 90 top
W1_R_LED10  20.75,60.75 90 top
W1_R_LED11  30.75,60.75 90 top
W1_R_LED12  40.75,60.75 90 top
W1_R_LED13  50.75,60.75 90 top
W1_R_LED14  60.75,60.75 90 top
W1_R_LED15  70.75,60.75 90 top
W1_R_LED16  80.75,60.75 90 top
W1_SENSOR  97,28.75 0 top
W1_VDIV_H  36.25,25.75 180 bottom
W1_VDIV_L  33.75,25.75 0 bottom
W2_PWR  4.5,34.75 0 top
W2_PWR_PAD  10.75,21.5 0 bottom
W2_SENSOR  4.5,16.25 0 top
W2_VDIV_H  17.25,19.5 0 bottom
W2_VDIV_L  19.75,19.5 180 bottom
W_GND  97,52.25 90 top
W_VCC  4.5,64.75 180 top

### Tracks (layer width: path | path; a pad name or v marks a point on that pad's centre or on a via)
3V3  (via drill 0.3, 0.3 pad 0.5)
  Top 0.127: v42.25,14.62 v42.25,11.88 | v42.86,25.28 43.81,25.28 v44.83,24.26 44.83,23.75 v44.45,23.37 42.48,23.37 41.97,22.86 39.62,22.86 39.37,23.11 38.99,23.11 38.73,22.86 38.73,22.48 41.97,19.24 v42.23,19.24
  Bottom 0.127: U$9.VCC 48.84,5.28 v42.25,11.88 | U$17.9 42.25,19.24 | 42.25,19.24 v42.25,14.62 | U$17.25 38.8,25.08 38.8,25.21 39.88,26.29 41.15,26.29 42.23,25.21 42.23,25.08 U$17.32 42.23,25.27 v42.85,25.27 v42.86,25.28 | v44.83,24.26 44.89,24.26 45.34,24.7 C16.1 | v44.45,23.37 44.45,23.24 45.15,22.54 C8.1 45.21,22.48 45.46,22.48 45.91,22.04 46.86,22.04 47.81,22.99 REG.2 47.88,22.99 49.84,22.99 50.67,22.16 52,22.16 REG1.1 | v42.23,19.24 42.25,19.24
5V  (via drill 0.3 pad 0.5)
  Top 0.127: v73.75,21.75 71.25,21.75 v68.75,24.25
  Bottom 0.127: 5V.P$1 74.25,21.25 v73.75,21.75 | v68.75,24.25 67.8,24.25 5V_VDIV_H.2
+BAT_SWITCH  (via drill 0.3 pad 0.5, 0.8 pad 0.5, 0.91 pad 0.5)
  Top 0.127: 50.75,34.12 51.25,33.62 v51.25,28.39
  Top 1.016: v83.75,59.25 81.4,59.25 W1_R_LED16.1 79.6,58.75 79.35,58.75 | W_VCC.P$1 4.75,64.75 9.6,59.9 W1_R_LED9.1 11.9,58.75 | R_LED9.1 92.22,10.88 | 92.22,10.88 89,10.88 | 89,10.88 85.79,10.88 | 85.79,10.88 75.75,10.88 | 75.75,10.88 65.78,10.88 | 65.78,10.88 55.75,10.88 | 55.75,10.88 45.78,10.88 | 45.78,10.88 35.75,10.88 | 35.75,10.88 25.78,10.88 | 25.78,10.88 15.75,10.88 | 15.75,10.88 6.77,10.88 R_LED0.1 | +BAT_SWITCH3.P$1 94.1,12.75 92.22,10.88 | R_LED35.1 94.72,34.12 v88.75,34.12 85.79,34.12 | 15.75,34.12 9.27,34.12 R_LED26.1 7.74,34.99 5.01,32.26 +BAT_SWITCH4.P$1 | 15.75,34.12 25.78,34.12 | 25.78,34.12 35.75,34.12 | 35.75,34.12 45.78,34.12 | 45.78,34.12 50.75,34.12 55.75,34.12 | 89,10.88 88.75,11.12 v88.75,15.25 | 79.35,58.75 70.8,58.75 | 70.8,58.75 60.77,58.75 | 60.77,58.75 v50.75,58.75 | v50.75,58.75 40.76,58.75 | 40.76,58.75 30.8,58.75 | 30.8,58.75 20.76,58.75 | 20.76,58.75 11.9,58.75 | 11.9,58.75 10.75,57.6 W1_R_LED0.1 10,57.35 2.25,49.6 2.25,33.51 3.51,32.26 +BAT_SWITCH4.P$1 | W1_R_LED7.1 79.35,58.75 | 85.79,34.12 75.75,34.12 | 75.75,34.12 65.78,34.12 | 65.78,34.12 55.75,34.12 | U$1.1 93.7,63.12 94.51,62.32 v94.57,62.32 95.69,61.19 v97,61.19 | U$1.1 93.62,64.82 93.62,66.38 v94.5,67.25 95.5,68.25 v97,68.25 | v93.5,64.75 93.53,64.77 U$1.1 | 15.75,10.88 15.75,9.91 R_LED1.1 | R_LED10.1 15.75,10.88 | 25.78,10.88 25.78,9.91 R_LED2.1 | R_LED11.1 25.78,11.81 25.78,10.88 | 35.75,10.88 35.75,9.91 R_LED3.1 | R_LED12.1 35.75,10.88 | R_LED18.1 15.75,33.21 15.75,34.12 | 15.75,34.12 15.75,35.12 R_LED27.1 | 45.78,10.88 45.78,9.91 R_LED4.1 | R_LED13.1 45.78,11.81 45.78,10.88 | R_LED19.1 25.78,33.21 25.78,34.12 | 25.78,34.12 25.78,35.12 R_LED28.1
  Top 1.016: 55.75,10.88 55.75,9.91 R_LED5.1 | R_LED14.1 55.75,10.88 | R_LED20.1 35.75,33.21 35.75,34.12 | 35.75,34.12 35.75,35.12 R_LED29.1 | 65.78,10.88 65.78,9.91 R_LED6.1 | 20.76,58.75 20.76,57.4 W1_R_LED1.1 | R_LED15.1 65.78,11.81 65.78,10.88 | 20.76,58.75 20.76,59.88 W1_R_LED10.1 | R_LED21.1 45.78,33.21 45.78,34.12 | 45.78,34.12 45.78,35.12 R_LED30.1 | 75.75,10.88 75.75,9.91 R_LED7.1 | 30.8,58.75 30.8,57.4 W1_R_LED2.1 | R_LED16.1 75.75,10.88 | 30.8,58.75 30.8,59.88 W1_R_LED11.1 | R_LED22.1 55.75,33.21 55.75,34.12 | 55.75,34.12 55.75,35.12 R_LED31.1 | 85.79,10.88 85.79,9.91 R_LED8.1 | 40.76,58.75 40.76,57.4 W1_R_LED3.1 | R_LED17.1 85.79,11.81 85.79,10.88 | 40.76,58.75 40.76,59.88 W1_R_LED12.1 | R_LED23.1 65.78,33.21 65.78,34.12 | 65.78,34.12 65.78,35.12 R_LED32.1 | W1_R_LED4.1 50.8,57.4 50.8,58.29 v50.75,58.75 | W1_R_LED13.1 50.8,59.88 50.8,59.24 v50.75,58.75 | R_LED24.1 75.75,33.21 75.75,34.12 | 75.75,34.12 75.75,35.12 R_LED33.1 | 60.77,58.75 60.77,57.4 W1_R_LED5.1 | 60.77,58.75 60.77,59.88 W1_R_LED14.1 | R_LED25.1 85.79,33.21 85.79,34.12 | 85.79,34.12 85.79,35.12 R_LED34.1 | 70.8,58.75 70.8,57.4 W1_R_LED6.1 | 70.8,58.75 70.8,59.88 W1_R_LED15.1 | +BAT_SWITCH4.P$1
  Bottom 0.127: REG.3 50.42,22.05 50.69,21.79 52.56,21.79 REG1.4 53.12,22.18 53.12,22.82 REG1.3 52.95,24.56 51.25,26.26 v51.25,28.39
  Bottom 1.016: +BAT_SWITCH1.P$1 88.75,25.38 | 88.75,25.38 v88.75,34.12 | +BAT_SWITCH1.P$1 v88.75,15.25 | +BAT.P$1 70.25,23 72.62,25.38 88.75,25.38 | v83.75,59.25 84.62,58.38 92.86,58.38 95.77,61.19 v97,61.19 | BAT_VDIV_H.2 88.5,23.25 +BAT_SWITCH1.P$1 | v94.57,62.32 94.56,62.32 | +BAT_SWITCH2.P$1 12.7,21.53 12.7,29.83 5.52,37.01 3.56,37.01 2.25,35.7 2.25,33.58 3.43,32.4 +BAT_SWITCH4.P$1
ANT1
  Bottom 0.254: U$17.19 37.4,21.65 36.15,20.4 C3.1 35.65,20 L3.1
ANT2
  Bottom 0.127: C6.1 C15.1
  Bottom 0.254: L3.2 C15.1
BUTTON  (via drill 0.3, 0.3 pad 0.5)
  Top 0.127: U$5.1 82.38,2.5 v81.25,2.5 | v82,14.75 v82,12.25 | v54.16,21.53 60.89,21.53 63.74,24.37 67.83,24.37 72.58,19.62 v81.15,19.62
  Bottom 0.127: v81.25,2.5 82,3.25 v82,12.25 | v82,14.75 82,19.62 | 82,19.62 BUTTON.P$1 | v54.16,21.53 50.38,21.53 49.46,21.53 49.27,21.72 43.05,21.72 U$17.6 | 82,19.62 v81.15,19.62
GND  (via drill 0.3, 0.3 pad 0.45, 0.3 pad 0.5)
  Top 0.127: v80.25,12.25 v80.25,14.75 | v80.25,2.5 79.12,2.5 U$5.2 | v48.89,21.14 48.89,21.39 v50.48,22.98 50.86,22.98 51.3,23.43 v56.77,23.43 | v25.49,24.94 25.26,24.94 v20.51,20.19 | U3.12 65.25,22.5 | 65.25,22.5 66,22.5 | 66,22.5 66.75,22.5 | U3.2 65.25,23.25 65.25,22.5 | U3.3 66,22.5 | U3.4 66.8,22.55 66.75,22.5 | 66.75,22.5 U3.6 68,22.5 v68.75,21.75
  Bottom 0.127: C11.1 34.6,23.25 HFXO1.2 34.15,23.1 HFXO1.4 | HFXO1.4 32.8,23.95 C12.1 31.5,23.5 31.5,22.75 32.12,22.12 | 32.12,22.12 32.75,21.5 33.6,21.5 C7.1 34.6,20.5 35.35,20.5 C3.2 36.33,21.2 37.28,22.15 U$17.20 40.25,22.15 U$17.EXP 40.75,22.65 U$17.29 | C6.2 32.1,22.1 32.12,22.12 | v80.25,14.75 GND_BT.P$1 80.26,21.27 80.25,21.27 | v80.25,12.25 v80.25,2.5 79,1.25 U$9.GND | BAT_VDIV_L.2 83.7,23 80.25,23 | U1.7 60.51,23.3 60.96,23.3 U1.8 | U1.3 60.96,21.78 60.96,21.91 60.58,22.29 U1.5 60.51,22.29 60.51,22.73 U1.6 60.51,22.8 60.51,23.24 U1.7 | 67.75,18.5 67.75,20.64 5V_VDIV_L.2 | IC1.2 65.02,24 65.15,24 65.72,24.57 66.29,24.57 66.99,23.88 66.99,21.4 67.69,20.7 5V_VDIV_L.2 | U1.7 60.45,23.3 58.61,23.3 R1.2 | LDR_PDW.2 45.21,20.95 45.46,20.95 45.91,20.51 47.24,20.51 47.81,21.08 REG.1 47.88,21.14 v48.89,21.14 | REG1.5 52.45,22.54 52.19,22.8 52.07,22.8 REG1.2 51.84,22.98 v50.48,22.98 50.23,22.98 49.4,23.81 46.23,23.81 C5.2 | C5.2 46.16,23.81 46.16,24.7 C16.2 46.16,24.77 46.16,25.72 C13.1 46.1,25.78 44.32,27.56 40.56,27.56 | C8.2 46.29,22.54 46.29,23.56 46.16,23.69 C5.2 | v20.51,20.19 20.32,20 20.32,19.56 W2_VDIV_L.2 | 40.56,27.56 34.79,27.56 34.09,28.26 33.72,28.26 33.21,27.74 33.21,25.78 W1_VDIV_L.2 32.33,26.62 25.87,26.62 25.49,26.25 v25.49,24.94 | v56.77,23.43 58.15,23.43 | 40.56,27.56 37.88,24.88 33.48,24.88 33.05,24.45 HFXO1.4 | v68.75,21.75 68.75,21.7 5V_VDIV_L.2
  Bottom 1.016: 77,24 73.5,24 72.25,22.75 -BAT.P$1 72.25,19.5 71.25,18.5 67.75,18.5 60.03,18.5 R2.2 R1.2 58.15,23.43 R3.2 | 77,24 79.25,24 80.25,23 80.25,21.27 GND_BT.P$1 | GND.P$1 77,24
GND_SHUNT  (via drill 0.3)
  Top 0.127: v44,22.29 44.88,22.29 46.99,24.4 v47.05,24.4
  Bottom 0.127: MFET_PDW1.2 24.45,25.5 | MFET_PDW.2 20.95,25.5 | MFET_PDW2.2 17.32,25.5 17.45,25.38 | v44,22.29 43.05,22.29 U$17.5 | 24.45,26.54 24.51,26.54 24.45,27 | 46.62,29.5 47.05,29.08 v47.05,24.4
  Bottom 1.016: MFET2.2 17.45,25.38 17.45,26.45 18,27 21.75,27 | 21.75,27 20.95,26.2 20.95,25.5 MFET.2 | MFET1.2 24.45,25.5 24.45,26.54 24.45,26.95 27,29.5 46.62,29.5 53.25,29.5 55.35,27.4 R3.1 R1.1 R2.1 | 24.45,27 21.75,27
INPUT_V  (via drill 0.3)
  Top 0.127: v66.1,25.15 65.28,25.97 43.75,25.97 43.59,26.14 41.18,26.14 v40.89,25.84
  Bottom 0.127: 5V_VDIV_L.1 67.75,21.84 67.75,23.18 5V_VDIV_H.1 67.69,23.24 67.24,23.69 67.24,24 v66.1,25.15 | v40.89,25.84 40.26,25.21 40.26,25.08 U$17.28
LDR  (via drill 0.3)
  Top 0.127: v39.18,22.67 39.43,22.67 40.07,22.04 43.62,22.04 43.81,21.84 46.99,21.84 | 46.99,21.84 47.63,21.84 49.99,24.2 U$3.P$2 | 46.99,21.84 v46.99,21.27
  Bottom 0.127: v39.18,22.67 39.18,23.24 39.75,23.81 39.75,25.02 U$17.27 | v46.99,21.27 46.73,21.02 46.35,21.02 LDR_PDW.1
LED_B  (via drill 0.3)
  Top 0.127: v40.19,19.24 38.92,19.24 38.6,18.92 22.73,18.92 22.54,19.11 8.06,19.11 5.78,21.4 5.78,22.48 5.2,23.05 U$6.B | v41.21,16.13 41.39,16.31 90.6,16.31 96.14,21.84 96.33,21.84 U$4.B
  Bottom 0.127: U$17.13 40.19,19.94 v40.19,19.24 40.19,17.14 v41.21,16.13
LED_G  (via drill 0.3)
  Top 0.127: U$6.G 5.2,21.84 5.2,21.59 9.59,17.21 40.64,17.21 v40.7,17.27 41.15,16.83 88.93,16.83 94.58,22.48 95.56,22.48 96.14,23.05 96.33,23.05 U$4.G
  Bottom 0.127: v40.7,17.27 40.7,19.94 U$17.12
LED_R  (via drill 0.3)
  Top 0.127: U$6.R 6.41,21.84 6.98,21.27 12.32,21.27 15.8,24.75 18.37,24.75 19.1,25.49 33.82,25.49 v38.67,20.64 | v41.78,17.27 41.95,17.1 88.69,17.1 94.65,23.05 95.12,23.05 U$4.R
  Bottom 0.127: v38.67,20.64 40.7,20.64 41.21,20.13 41.21,20 U$17.11 41.27,19.94 41.27,19.81 41.78,19.3 v41.78,17.27
MAIN_LED_CTRL
  Bottom 0.127: MFET_PDW.1 19.43,25.48 19.43,24.12 MFET.1 19.43,24.07 20.63,22.86 23.56,22.86 24.2,22.22 24.2,16.93 25.63,15.49 39.3,15.49 39.75,15.94 U$17.14
MAIN_LED_GND  (via drill 0.8 pad 0.5, 0.91 pad 0.5)
  Top 1.016: 70.8,66.25 W1_LED16.C 86.75,66.25 | 70.8,66.25 W1_LED15.C | W1_LED15.C 60.77,66.25 | 60.77,66.25 W1_LED14.C | W1_LED14.C 50.8,66.25 | 50.8,66.25 W1_LED13.C | W1_LED13.C 40.76,66.25 | 40.76,66.25 W1_LED12.C | W1_LED12.C 30.8,66.25 | 30.8,66.25 W1_LED11.C | W1_LED11.C 20.76,66.25 | 20.76,66.25 W1_LED10.C | W1_LED10.C W1_LED9.C | W1_LED0.C W1_LED1.C | W1_LED1.C 20.76,50.75 | 20.76,50.75 W1_LED2.C | W1_LED2.C 30.8,50.75 | 30.8,50.75 W1_LED3.C | W1_LED3.C 40.76,50.75 | 40.76,50.75 W1_LED4.C W1_LED5.C | W1_LED5.C 60.77,50.75 | 60.77,50.75 W1_LED6.C | W1_LED6.C 70.8,50.75 | 70.8,50.75 W1_LED7.C 83.75,50.75 86.75,53.75 | 86.75,66.25 89.53,66.25 U$1.2 | 86.75,53.75 86.75,66.25 | 86.75,53.75 88.25,52.25 W_GND.P$1 98.25,51 98.25,44 LED35.C 85.79,41.5 | LED26.C LED27.C | LED27.C 15.81,41.5 | 15.81,41.5 LED28.C | LED28.C 25.78,41.5 | 25.78,41.5 LED29.C | LED29.C | LED29.C LED30.C | LED30.C 45.78,41.5 | 45.78,41.5 LED31.C | LED31.C | LED31.C LED32.C | LED32.C 65.78,41.5 | 65.78,41.5 LED33.C | LED33.C | LED33.C v81.12,41.5 LED34.C | LED34.C 85.79,41.5 | 81.15,26.83 LED25.C LED17.C LED16.C | 81.15,26.83 LED24.C | LED24.C | LED24.C 65.78,26.83 | 65.78,26.83 LED23.C | LED23.C LED22.C | LED22.C | LED22.C 45.78,26.83 | 45.78,26.83 LED21.C | LED21.C LED20.C | LED20.C | LED20.C 25.78,26.83 | 25.78,26.83 LED19.C | LED19.C LED18.C | LED7.C 77.19,3.5 78.25,4.56 83.25,4.56 84.31,3.5 LED8.C LED9.C | LED7.C | LED7.C 65.78,3.5 | 65.78,3.5 LED6.C | LED6.C LED5.C | LED5.C | LED5.C 45.78,3.5 | 45.78,3.5 LED4.C | LED4.C LED3.C | LED3.C | LED3.C 25.78,3.5 | 25.78,3.5 LED2.C | LED2.C v21.38,3.5 15.81,3.5 | 15.81,3.5 LED1.C | LED1.C LED0.C | LED10.C 18.12,18.17 | 18.12,18.17 21.5,18.17 | 21.5,18.17 LED11.C | LED11.C 25.78,18.17 | 25.78,18.17 LED12.C
  Top 1.016: LED12.C | LED12.C LED13.C | LED13.C 45.78,18.17 | 45.78,18.17 LED14.C | LED14.C | LED14.C LED15.C | LED15.C 65.78,18.17 | 65.78,18.17 LED16.C | LED16.C | 21.5,18.17 v21.5,18.12 | U$1.2 91.03,62.22 v92.75,60.5 94.5,58.75 v97,58.75 | v97,70.75 94.72,70.75 92.85,68.88 v92.75,69 91.03,67.16 U$1.2 | W1_LED1.C 20.76,50.74 20.76,50.75 | W1_LED2.C 30.8,50.74 30.8,50.75 | W1_LED10.C 20.76,66.23 20.76,66.25 | W1_LED3.C 40.76,50.74 40.76,50.75 | W1_LED11.C 30.8,66.23 30.8,66.25 | W1_LED12.C 40.76,66.23 40.76,66.25 | W1_LED5.C 60.77,50.74 60.77,50.75 | W1_LED13.C 50.8,66.23 50.8,66.25 | W1_LED6.C 70.8,50.74 70.8,50.75 | W1_LED14.C 60.77,66.23 60.77,66.25 | W1_LED15.C 70.8,66.23 70.8,66.25 | LED27.C 15.81,41.53 15.81,41.5 | LED1.C 15.81,3.49 15.81,3.5 | 45.78,3.5 45.78,3.49 LED4.C | LED2.C 25.78,3.49 25.78,3.5 | LED3.C | LED11.C 25.78,18.16 25.78,18.17 | LED19.C 25.78,26.86 25.78,26.83 | LED12.C | v81.12,26.95 81.15,26.92 81.15,26.83 | LED5.C | LED20.C 35.75,26.86 LED20.C | LED13.C 45.78,18.16 45.78,18.17 | LED28.C 25.78,41.53 25.78,41.5 | LED6.C 65.78,3.49 65.78,3.5 | LED21.C 45.78,26.86 45.78,26.83 | LED14.C | LED29.C 35.75,41.53 LED29.C | LED7.C | LED22.C 55.75,26.86 LED22.C | LED15.C 65.78,18.16 65.78,18.17 | LED30.C 45.78,41.53 45.78,41.5 | LED23.C 65.78,26.86 65.78,26.83 | LED16.C | LED31.C 55.75,41.53 LED31.C | LED24.C 75.75,26.86 LED24.C | LED32.C 65.78,41.53 65.78,41.5 | LED33.C 75.75,41.53 LED33.C | LED34.C 85.79,41.53 85.79,41.5 | 18.12,18.17 18,18.29
  Bottom 1.016: v21.38,3.5 21.5,3.62 v21.5,18.12 21.5,20.5 20.35,21.65 MFET.3 19.35,21 v19.25,21 | v81.12,41.5 v81.12,26.95
  other vias: 91.03,64.75
  pour Top: 0.5,-1.51 0.5,68.19 87.75,68.19 87.75,46.38 101,46.38 101,-1.51
  pour Bottom: 0.38,68.19 100.96,68.19 100.96,-1.07 0.38,-1.07
MEAS_BAT  (via drill 0.3)
  Top 0.127: v42.35,21.59 46.03,21.59 47.63,19.99 51.75,19.99 53.73,21.98 60.97,21.98 63.69,24.7 83.5,24.7 v84.33,23.88
  Bottom 0.127: BAT_VDIV_L.1 84.95,22.85 BAT_VDIV_H.1 84.9,23.3 v84.33,23.88 | v42.35,21.59 42.35,22.16 42.73,22.54 42.8,22.54 42.99,22.73 U$17.4
N$1  (via drill 2)
  other vias: 17.25,73.5
N$3
  Bottom 0.254: C15.2 30.05,22.05 30.05,22.25
  Bottom 0.305: 30.05,22.25 ANT1.P1
N$4
  Bottom 0.127: C7.2 35.65,21.75 36.32,21.75 37.72,23.15 U$17.22
N$5
  Top 1.016: R_LED0.2 5.78,8.13 5.78,6.54 LED0.A
N$6
  Bottom 0.127: C13.2 45.34,25.72 44.18,25.72 43.04,24.57 41.59,24.57 41.27,24.89 41.27,25.02 U$17.30
N$8
  Top 1.016: R_LED1.2 15.75,8.13 15.75,6.54 LED1.A
N$9  (via drill 0.3)
  Top 0.127: v7.17,22.29 6.41,23.05 U$6.COM 6.35,23.11 5.78,23.69 4.7,23.69 4.57,23.56 4.57,21.4 9.14,16.83 39.11,16.83 39.37,16.57 90.06,16.57 95.15,21.67 U$4.COM
  Bottom 0.127: v7.17,22.29 7.81,21.65 7.81,20.64 R_RGB.2
N$10
  Top 1.016: R_LED2.2 25.78,8.13 25.78,6.54 LED2.A
N$11
  Bottom 0.127: U$17.23 37.91,23.79 37.75,23.79 36.09,22.12 33.38,22.12 33.05,22.45 HFXO1.3 32.3,22.8 C12.2
N$12
  Bottom 0.127: C11.2 35.1,24.2 HFXO1.1 34.57,24.62 36.13,24.62 36.25,24.5 36.25,23.62 36.38,23.5 36.62,23.5 36.75,23.62 36.75,24.5 36.88,24.62 37.13,24.62 37.25,24.5 37.25,24.38 37.38,24.25 U$17.24
N$13
  Top 1.016: R_LED3.2 35.75,8.13 35.75,6.54 LED3.A
N$14
  Bottom 0.127: C5.1 45.34,23.81 43.62,23.81 43.24,24.19 43.05,24.19 U$17.1
N$15
  Top 1.016: R_LED4.2 45.78,8.13 45.78,6.54 LED4.A
N$17
  Top 1.016: R_LED5.2 55.75,8.13 55.75,6.54 LED5.A
N$18
  Top 1.016: R_LED6.2 65.78,8.13 65.78,6.54 LED6.A
N$19
  Top 1.016: R_LED7.2 75.75,8.13 75.75,6.54 LED7.A
N$20
  Top 1.016: R_LED8.2 85.79,8.13 85.79,6.54 LED8.A
N$21
  Top 1.016: R_LED9.2 93.28,8.13 94.11,8.13 95.69,6.54 LED9.A
N$22
  Top 1.016: R_LED10.2 15.75,15.11 LED10.A
N$23
  Top 1.016: R_LED11.2 25.78,13.53 25.78,15.11 LED11.A
N$24
  Top 1.016: R_LED12.2 35.75,15.11 LED12.A
N$25
  Top 1.016: R_LED13.2 45.78,13.53 45.78,15.11 LED13.A
N$26
  Top 1.016: R_LED14.2 55.75,15.11 LED14.A
N$27
  Top 1.016: R_LED15.2 65.78,13.53 65.78,15.11 LED15.A
N$28
  Top 1.016: R_LED16.2 75.75,15.11 LED16.A
N$29
  Top 1.016: R_LED17.2 85.79,13.53 85.79,15.11 LED17.A
N$30
  Top 1.016: R_LED18.2 15.75,31.43 15.75,29.84 LED18.A
N$31
  Top 1.016: R_LED19.2 25.78,31.43 25.78,29.84 LED19.A
N$32
  Top 1.016: R_LED20.2 35.75,31.43 35.75,29.84 LED20.A
N$33
  Top 1.016: R_LED21.2 45.78,31.43 45.78,29.84 LED21.A
N$34
  Top 1.016: R_LED22.2 55.75,31.43 55.75,29.84 LED22.A
N$35
  Top 1.016: R_LED23.2 65.78,31.43 65.78,29.84 LED23.A
N$36
  Top 1.016: R_LED24.2 75.75,31.43 75.75,29.84 LED24.A
N$37
  Top 1.016: R_LED25.2 85.79,31.43 85.79,29.84 LED25.A
N$38
  Top 1.016: R_LED26.2 8.19,36.89 7.36,36.89 5.78,38.48 LED26.A
N$39
  Top 1.016: R_LED27.2 15.75,36.89 15.75,38.48 LED27.A
N$40
  Top 1.016: R_LED28.2 25.78,36.89 25.78,38.48 LED28.A
N$41
  Top 1.016: R_LED29.2 35.75,36.89 35.75,38.48 LED29.A
N$42
  Top 1.016: R_LED30.2 45.78,36.89 45.78,38.48 LED30.A
N$43
  Top 1.016: R_LED31.2 55.75,36.89 55.75,38.48 LED31.A
N$44
  Top 1.016: R_LED32.2 65.78,36.89 65.78,38.48 LED32.A
N$45
  Top 1.016: R_LED33.2 75.75,36.89 75.75,38.48 LED33.A
N$46
  Top 1.016: R_LED34.2 85.79,36.89 85.79,38.48 LED34.A
N$47
  Top 1.016: R_LED35.2 95.75,36.89 95.75,38.48 LED35.A
N$48
  Top 1.016: W1_R_LED0.2 W1_LED0.A
N$49
  Top 0.127: W1_R_LED1.2 20.76,55.63 20.76,53.78 W1_LED1.A
N$50
  Top 0.127: W1_R_LED2.2 30.8,55.63 30.8,53.78 W1_LED2.A
N$51
  Top 0.127: W1_R_LED3.2 40.76,55.63 40.76,53.78 W1_LED3.A
N$52
  Top 0.127: W1_R_LED4.2 50.8,55.63 50.8,53.78 W1_LED4.A
N$53
  Top 0.127: W1_R_LED5.2 60.77,55.63 60.77,53.78 W1_LED5.A
N$54
  Top 0.127: W1_R_LED6.2 70.8,55.63 70.8,53.78 W1_LED6.A
N$55
  Top 0.127: W1_R_LED7.2 80.77,55.63 80.77,53.78 W1_LED7.A
N$59
  Top 0.127: W1_R_LED9.2 10.79,61.66 10.79,63.25 W1_LED9.A
N$60
  Top 0.127: W1_R_LED10.2 20.76,61.66 20.76,63.25 W1_LED10.A
N$61
  Top 0.127: W1_R_LED11.2 30.8,61.66 30.8,63.25 W1_LED11.A
N$62
  Top 0.127: W1_R_LED12.2 40.76,61.66 40.76,63.25 W1_LED12.A
N$63
  Top 0.127: W1_R_LED13.2 50.8,61.66 50.8,63.25 W1_LED13.A
N$64
  Top 0.127: W1_R_LED14.2 60.77,61.66 60.77,63.25 W1_LED14.A
N$65
  Top 0.127: W1_R_LED15.2 70.8,61.66 70.8,63.25 W1_LED15.A
N$66
  Top 0.127: W1_R_LED16.2 80.77,61.66 80.77,63.25 W1_LED16.A
RGB_COMMON  (via drill 0.3)
  Top 0.127: v9.71,21.72 12.38,21.72 16.73,26.07 36.79,26.07 38.54,24.32 v38.67,24.32
  Bottom 0.127: v9.71,21.72 9.71,21.65 8.7,20.64 R_RGB.1 | v38.67,24.32 39.24,24.89 39.24,25.02 U$17.26
SCL  (via drill 0.3, 0.3 pad 0.45)
  Top 0.127: v62.04,23.88 57.85,23.88 56.96,22.99 51.22,22.99 49.59,21.35 v49.59,20.81 | U3.10 65.2,21.45 64.64,20.89 v63.5,20.89
  Bottom 0.127: 62.42,21.72 63.31,21.72 63.94,21.08 IC1.6 63.66,21.05 v63.5,20.89 | 62.42,21.72 62.04,21.72 U1.1 | U$17.7 43.05,21.21 44.13,21.21 45.21,20.13 47.81,20.13 48.64,19.3 SCL_PUP.1 48.73,19.95 v49.59,20.81 | 62.42,21.72 62.42,23.5 v62.04,23.88
SDA  (via drill 0.3)
  Top 0.127: v63.31,23.3 v61.15,21.14 60.13,20.12 | v47.75,19.24 59.24,19.24 60.13,20.12 | U3.9 66,21.45 64.67,20.12 60.13,20.12
  Bottom 0.127: U$17.8 43.92,19.88 45.67,19.88 SDA_PUP.1 46.35,19.24 v47.75,19.24 | v61.15,21.14 60.96,21.14 60.51,21.59 60.51,21.72 U1.4 | v63.31,23.3 63.94,23.94 IC1.1
SENSOR_PWR  (via drill 0.3 pad 0.45)
  Top 0.127: U3.5 67.6,23.65 67.25,24 64.75,24 64.4,23.65 U3.1 64.3,23.3 63.75,22.75 63.75,22 | U3.11 64.05,21.7 63.75,22 | 63.75,22 v62.43,20.68
  Bottom 0.127: 50.75,20.2 SCL_PUP.2 49.17,18.62 45.83,18.62 SDA_PUP.2 43.75,19.25 42.5,20.5 41.88,20.5 41.75,20.38 U$17.10 | 50.75,20.2 U$3.P$1 | U1.9 61.53,23.24 61.53,21.78 U1.2 61.53,21.72 61.53,21.59 v62.43,20.68 62.67,20.45 64.39,20.45 64.96,21.02 IC1.5 | U1.10 61.97,23.24 61.59,23.24 U1.9 | U1.9 61.47,23.3 61.47,23.43 59.18,25.72 57.28,25.72 56.32,24.77 56.32,19.37 56.26,19.3 51.69,19.3 50.8,20.19 50.75,20.2
SWDCLK  (via drill 0.3 pad 0.5)
  Top 0.127: U$9.SWDCLK v51.38,2.61 | v40.88,12.5 39,14.38 v39,16.25
  Bottom 0.127: v39,16.25 v38.99,16.25 37.95,17.29 U$17.17 | v40.88,12.5 41.12,12.75 42.86,12.75 51.38,4.24 v51.38,2.61
SWDIO  (via drill 0.3 pad 0.5)
  Top 0.127: U$9.SWDIO 50.12,2.6 v50.12,2.61 | v40,12.25 38,14.25 v38,16.25
  Bottom 0.127: v40,12.25 40.25,12 41.37,12 41.82,12.44 42.67,12.44 50.12,4.99 v50.12,2.61 | v38,16.25 37.25,17 37.25,21 37.5,21.25 U$17.18
WING1_LEDS_CTRL
  Bottom 0.127: MFET_PDW1.1 22.95,24.15 22.83,24.03 | 22.83,24.03 MFET1.1 | U$17.15 39.3,19.94 39.3,16.64 39.49,16.45 39.49,16.07 39.18,15.75 25.88,15.75 24.58,17.05 24.58,22.29 22.83,24.03
WING1_POWER
  Bottom 1.016: W1_PWR.P$1 94,10.25 90.75,13.5 | 90.75,13.5 W1_PWR_PAD.P$1 | MFET1.3 23.5,15.38 25.38,13.5 90.75,13.5
WING1_SENSOR  (via drill 0.3)
  Top 0.127: v41.96,24.06 41.83,24.19 40.81,24.19 39.09,25.91 v37.84,25.91
  Bottom 0.127: W1_VDIV_L.1 34.35,25.78 35.68,25.78 W1_VDIV_H.1 35.75,25.78 36.19,26.23 37.21,26.23 37.53,25.91 v37.84,25.91 | v41.96,24.06 42.11,24.06 42.42,23.75 U$17.2
WING1_SENSOR_IN  (via drill 0.3)
  Top 0.127: v33.91,27.81 80.71,27.81 81.59,28.7 96.96,28.7 W1_SENSOR.P$1
  Bottom 0.127: v33.91,27.81 34.88,26.84 37.79,26.84 38.41,26.22 38.41,25.85 37.94,25.38 37.17,25.38 W1_VDIV_H.2
WING2_LEDS_CTRL  (via drill 0.3)
  Top 0.127: v38.41,19.37 18.01,19.37 16.44,20.93 v16.44,23.56
  Bottom 0.127: MFET_PDW2.1 15.95,24.15 MFET2.1 15.94,24.07 v16.44,23.56 | v38.41,19.37 38.73,19.68 38.73,19.94 U$17.16
WING2_POWER
  Bottom 1.016: W2_PWR.P$1 10.75,28.5 W2_PWR_PAD.P$1 10.75,19.5 11.25,19 14,19 16.5,21.5 MFET2.3
WING2_SENSOR  (via drill 0.3)
  Top 0.127: v41.78,23.3 41.41,23.68 38.56,23.68 36.49,25.74 18.57,25.74 v18.37,25.54
  Bottom 0.127: W2_VDIV_H.1 W2_VDIV_L.1 18.37,20.33 v18.37,25.54 | v41.78,23.3 42.99,23.3 U$17.3
WING2_SENSOR_IN
  Bottom 0.127: W2_VDIV_H.2 13.45,16.25 W2_SENSOR.P$1